# Altium project STM32F407_board.PrjPcb
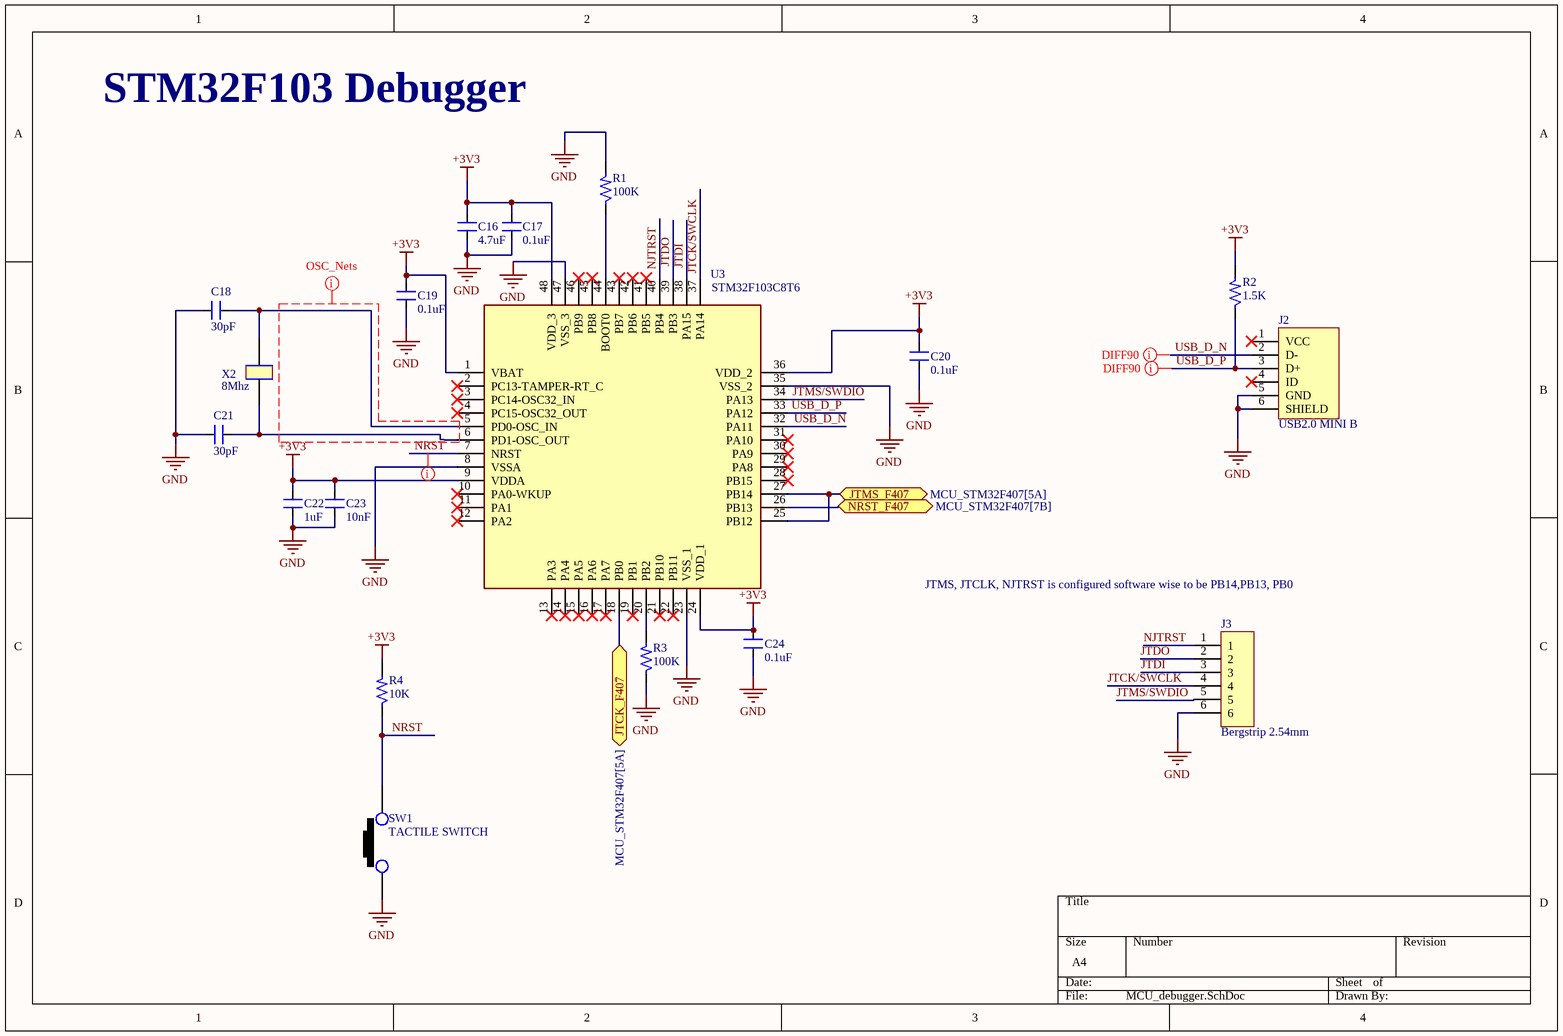
[diagram p0: MCU_debugger.SchDoc]
3 sheets, 73 parts. Net scope: flat (ports and power ports of the same name join across sheets).
Sheets:
  MCU_debugger.SchDoc
  Ethernet_PHY.SchDoc
  Motor_Driver.SchDoc

## Sheet MCU_debugger.SchDoc
size A4; DocumentNumber: 2; SheetNumber: 2; SheetTotal: 6

### Parts
C16  4.7uF  [CAP_0805]
C17  0.1uF  [CAP_0805]
C18  30pF  [CAP_0805]
C19  0.1uF  [CAP_0805]
C20  0.1uF  [CAP_0805]
C21  30pF  [CAP_0805]
C22  1uF  [CAP_0805]
C23  10nF  [CAP_0805]
C24  0.1uF  [CAP_0805]
J2  USB2.0 MINI B  [CON_690-005-299-043]
J3  Bergstrip 2.54mm  [CON6_100_59D78_TH_ST]
R1  100K  [RES_0603]
R2  1.5K  [RES_0805]
R3  100K  [RES_0603]
R4  10K  [RES_0603]
SW1  TACTILE SWITCH  [SW_342_SMD]
U3  STM32F103C8T6  [LQFP-48_19.6_393_58X11_SMD]
X2  8Mhz  [XTAL_314_240X47_SMD]

### Ports
JTCK_F407 (bidir, see MCU_STM32F407[5A]), JTMS_F407 (bidir, see MCU_STM32F407[5A]), NRST_F407 (bidir, see MCU_STM32F407[7B])

### Nets
+3V3: C16.2 C17.2 C19.2 C20.2 C22.2 C23.2 C24.2 R2.2 R4.2 U3.1(VBAT) U3.9(VDDA) U3.24(VDD_1) U3.36(VDD_2) U3.48(VDD_3)
GND: C16.1 C17.1 C18.1 C19.1 C20.1 C21.1 C22.1 C23.1 C24.1 J2.5(GND) J2.6(SHIELD) J3.6 R1.2 R3.1 SW1.1 U3.8(VSSA) U3.23(VSS_1) U3.35(VSS_2) U3.47(VSS_3)
JTCK/SWCLK: J3.4 U3.37(PA14)
JTDI: J3.3 U3.38(PA15)
JTDO: J3.2 U3.39(PB3)
JTMS/SWDIO: J3.5 U3.34(PA13)
NJTRST: J3.1 U3.40(PB4)
NRST: R4.1 SW1.2 U3.7(NRST)
USB_D_N: J2.2(D-) U3.32(PA11)
USB_D_P: J2.3(D+) R2.1 U3.33(PA12)
NetC18_2: C18.2 U3.5(PD0-OSC_IN) X2.2
NetC21_2: C21.2 U3.6(PD1-OSC_OUT) X2.1
NetR1_1: R1.1 U3.44(BOOT0)
NetR3_2: R3.2 U3.20(PB2)
NetU3_18: U3.18(PB0) ; port JTCK_F407
NetU3_25: U3.25(PB12) U3.27(PB14) ; port JTMS_F407
NetU3_26: U3.26(PB13) ; port NRST_F407

Not connected (* = marked no-connect by the designer): J2 1(VCC)* 4(ID)*; U3 2(PC13-TAMPER-RT_C)* 3(PC14-OSC32_IN)* 4(PC15-OSC32_OUT)* 10(PA0-WKUP)* 11(PA1)* 12(PA2)* 13(PA3)* 14(PA4)* 15(PA5)* 16(PA6)* 17(PA7)* 19(PB1)* 21(PB10)* 22(PB11)* 28(PB15)* 29(PA8)* 30(PA9)* 31(PA10)* 41(PB5)* 42(PB6)* 43(PB7)* 45(PB8)* 46(PB9)*

### Layout directives
differential pair; differential pair class DIFF90: USB_D_N, USB_D_P
net class OSC_Nets: GND
net class *: NRST

### Notes on the sheet
- STM32F103 Debugger
- (near J3) JTMS, JTCLK, NJTRST is configured software wise to be PB14,PB13, PB0

### Library data of the parts
C16 = CAP_4.7uF-50V-10%-0805: 4.7µF ±10% 50V Ceramic Capacitor X5R 0805 (2012 Metric); Manufacturer: Yageo; Manufacturer Part Number: GRM21BR61H475KE51L; Alternate Part Number-1: NA; Case/Package: 0805; Supplier-1: SIRICOM; Supplier Part Number-1: CL21A475KBQNNNE
C17 C19 C20 C24 = CAP_0.1uF-50V-5%-0805: 0.1µF ±5% 50V Ceramic Capacitor X7R 0805 (2012 Metric); Manufacturer: AVX Corporation; Manufacturer Part Number: 08055C104JAT4A; Alternate Part Number-1: 0805B104M500; Case/Package: 0805; Supplier-1: SIRICOM; Supplier Part Number-1: 0805B104J500CT
C18 C21 = CAP_30pF-50V-10%-0805: ±10% 50V Ceramic Capacitor C0G, NP0 0805 (2012 Metric); Manufacturer Part Number: C0805C300K5GAC7800; Manufacturer: KEMET; Alternate Part Number: NA; Case/Package: 0805; Supplier-1: Digikey; Supplier Part Number-1: 399-17443-1-ND - Cut Tape (CT)
C22 = CAP_1uF-50V-5%-0805: 1µF ±5% 50V Ceramic Capacitor X7R 0805 (2012 Metric); Manufacturer: Samsung; Manufacturer Part Number: CC0805JKX7R9BB105; Alternate Part Number-1: 0805F105M500NT; Case/Package: 0805; Supplier-1: SIRICOM; Supplier Part Number-1: CL21B105KBFNNNE
C23 = CAP_10nF-50V-10%-0805: 10000pF ±10% 50V Ceramic Capacitor X7R 0805 (2012 Metric); Manufacturer: Samsung; Manufacturer Part Number: C0805C103K5RECAUTO; Alternate Part Number-1: GRM2195C1H103JA01D; Case/Package: 0805; Supplier-1: SIRICOM; Supplier Part Number-1: 0805B103K500CT
J2 = CON_USB2.0-MINIB-SMD: USB - mini B USB 2.0 Receptacle Connector 5 Position Surface Mount, Right Angle; Manufacturer: EDAC; Manufacturer Part Number: 690-005-299-043; Alternate Part Number-1: NA; Case/Package: USB-MINI-B; Supplier-1: LCSC; Supplier Part Number-1: C105424
J3 = CON-BS-SKT_6X1-100-ST-TH: 6 Pins, 1 Row 2.54mm Pitch, Straight bergstrip, Female; Manufacturer: Molex; Alternate Part Number-1: NA; Manufacturer Part Number: 22-10-2061; Case/Package: TH-CON; Supplier-1: SP ROAD; Supplier Part Number-1: NA
R1 R3 = RES_100K-0.1W-1%-0603: 100 kOhms ±1% 0.1W, 1/10W Chip Resistor 0603 (1608 Metric) Automotive AEC-Q200 Thick Film; Manufacturer: Stackpole Electronics; Manufacturer Part Number: RMCF0603FT100K; Alternate Part Number-1: NA; Case/Package: 0603; Supplier-1: Arrow; Supplier Part Number-1: RMCF0603FT100K
R2 = RES_1.5K-0.125W-1%-0805: 1.5 kOhms ±1% 0.125W, 1/8W Chip Resistor 0805 (2012 Metric) Thick Film; Manufacturer: TE Connectivity Passive Product; Manufacturer Part Number: CRG0805F1K5; Alternate Part Number-1: NA; Case/Package: 0805; Supplier-1: SIRICOM; Supplier Part Number-1: NA
R4 = RES_10K-0.1W-1%-0603: 10 kOhms ±1% 0.1W, 1/10W Chip Resistor 0603 (1608 Metric) Automotive AEC-Q200 Thick Film; Manufacturer: Walsin; Manufacturer Part Number: WR06X1002FTL; Alternate Part Number-1: 0603WAJ0103T5E; Case/Package: 0603; Supplier-1: SIRICOM; Supplier Part Number-1: WR06X1002FTL
SW1 = SW1_RS-282G05A3-SMRT-SMD: Tactile Switch SPST-NO Top Actuated Surface Mount; Manufacturer: ITT C&K; Alternate Part Number-1: NA; Manufacturer Part Number: RS-282G05A3-SMRT; Case/Package: SMD; Supplier-1: SP ROAD; Supplier Part Number-1: RS-282G05A3-SMRT
U3 = IC_STM32F103C8T6: ARM® Cortex®-M3 STM32F1 Microcontroller IC 32-Bit 72MHz 64KB (64K x 8) FLASH 48-LQFP (7x7); Manufacturer: STMicroelectronics; Alternate Part Number-1: NA; Manufacturer Part Number: STM32F103C8T6; Case/Package: LQFP48; Supplier-1: LCSC; Supplier Part Number-1: STM32F103C8T6
X2 = XTAL_8MHZ-ECS-80-32-5PX-SMD: 8MHz ±30ppm Crystal 32pF 60 Ohms HC-49/US; Manufacturer: Fox Electronics; Manufacturer Part Number: ECS-80-32-5PX-TR; Alternate Part Number-1: NA; Case/Package: SMD/SMT; Supplier-1: SP ROAD; Supplier Part Number-1: ECS-80-32-5PX-TR

## Sheet Ethernet_PHY.SchDoc
size A4; DocumentNumber: 3; SheetNumber: 3; SheetTotal: 7
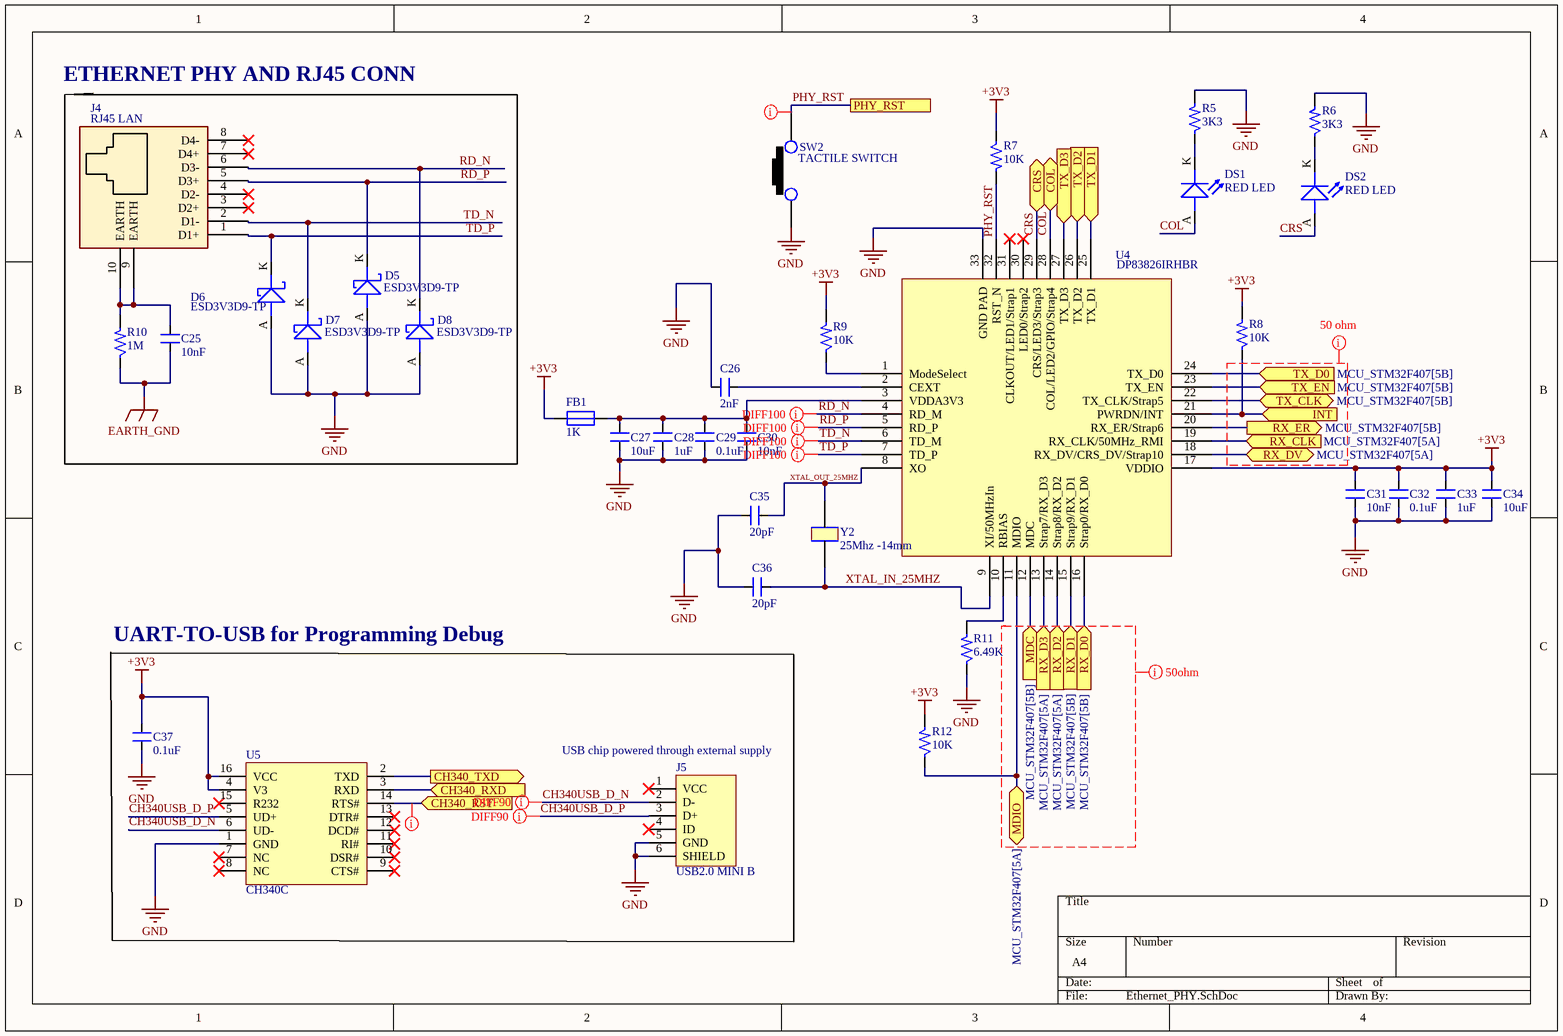
[diagram p1: Ethernet_PHY.SchDoc]

### Parts
C25  10nF  [CAP_P196_102X287_H332_RAD_TH]
C26  2nF  [CAP_0805]
C27  10uF  [CAP_1206]
C28  1uF  [CAP_0805]
C29  0.1uF  [CAP_0805]
C30  10nF  [CAP_0805]
C31  10nF  [CAP_0805]
C32  0.1uF  [CAP_0805]
C33  1uF  [CAP_0805]
C34  10uF  [CAP_1206]
C35  20pF  [CAP_0805]
C36  20pF  [CAP_0805]
C37  0.1uF  [CAP_0805]
D5  ESD3V3D9-TP  [DIO_SOD-923]
D6  ESD3V3D9-TP  [DIO_SOD-923]
D7  ESD3V3D9-TP  [DIO_SOD-923]
D8  ESD3V3D9-TP  [DIO_SOD-923]
DS1  RED LED  [LED_0805]
DS2  RED LED  [LED_0805]
FB1  1K  [IND_0805]
J4  RJ45 LAN  [CON10_P106_RJ45_TH_ST]
J5  USB2.0 MINI B  [CON_690-005-299-043]
R5  3K3  [RES_0603]
R6  3K3  [RES_0603]
R7  10K  [RES_0603]
R8  10K  [RES_0603]
R9  10K  [RES_0603]
R10  1M  [RES_1206]
R11  6.49K  [RES_0805]
R12  10K  [RES_0603]
SW2  TACTILE SWITCH  [SW_342_SMD]
U4  DP83826IRHBR  [VQFN32_19_218_23X9_SMD]
U5  CH340C  [SOIC16_50_284_25X90_SMT]
Y2  25Mhz -14mm  [XTAL_314_240X47_SMD]

### Blocks framed on the sheet
UART-TO-USB for Programming Debug: C37 J5 U5

### Ports
CH340_RST (in, see MCU_STM32F407[7B]), CH340_RXD (in, see MCU_STM32F407[5B]), CH340_TXD (out, see MCU_STM32F407[5B]), COL (bidir, see MCU_STM32F407[5A]), CRS (bidir, see MCU_STM32F407[5A]), INT (in), MDC (in, see MCU_STM32F407[5B]), MDIO (bidir, see MCU_STM32F407[5A]), PHY_RST (see MCU_STM32F407[5B]), RX_CLK (in, see MCU_STM32F407[5A]), RX_D0 (in, see MCU_STM32F407[5B]), RX_D1 (in, see MCU_STM32F407[5B]), RX_D2 (in, see MCU_STM32F407[5A]), RX_D3 (in, see MCU_STM32F407[5A]), RX_DV (bidir, see MCU_STM32F407[5A]), RX_ER (out, see MCU_STM32F407[5B]), TX_CLK (bidir, see MCU_STM32F407[5B]), TX_D0 (in, see MCU_STM32F407[5B]), TX_D1 (in, see MCU_STM32F407[5B]), TX_D2 (in, see MCU_STM32F407[5B]), TX_D3 (in, see MCU_STM32F407[7A]), TX_EN (in, see MCU_STM32F407[5B])

### Nets
+3V3: C31.2 C32.2 C33.2 C34.2 C37.2 FB1.1 R7.1 R8.2 R9.2 R12.2 U4.17(VDDIO) U5.4(V3) U5.16(VCC)
EARTH_GND: C25.1 R10.1
GND: C26.2 C27.1 C28.1 C29.1 C30.1 C31.1 C32.1 C33.1 C34.1 C35.1 C36.1 C37.1 D5.A D6.A D7.A D8.A J5.5(GND) J5.6(SHIELD) R5.2 R6.2 R11.1 SW2.1 U4.33(GND_PAD) U5.1(GND)
CH340USB_D_N: J5.2(D-) U5.6(UD-)
CH340USB_D_P: J5.3(D+) U5.5(UD+)
COL: DS1.A(ANODE) U4.28(COL/LED2/GPIO/Strap4) ; port COL
CRS: DS2.A(ANODE) U4.29(CRS/LED3/Strap3) ; port CRS
PHY_RST: R7.2 SW2.2 U4.32(RST_N) ; port PHY_RST
RD_N: D8.K J4.6(D3-) U4.4(RD_M)
RD_P: D5.K J4.5(D3+) U4.5(RD_P)
TD_N: D7.K J4.2(D1-) U4.6(TD_M)
TD_P: D6.K J4.1(D1+) U4.7(TD_P)
XTAL_IN_25MHZ: C36.2 U4.9(XI/50MHzIn) Y2.2
XTAL_OUT_25MHZ: C35.2 U4.8(XO) Y2.1
NetC25_2: C25.2 J4.9(EARTH) J4.10(EARTH) R10.2
NetC26_1: C26.1 U4.2(CEXT)
NetC27_2: C27.2 C28.2 C29.2 C30.2 FB1.2 U4.3(VDDA3V3)
NetDS1_K: DS1.K(CATHODE) R5.1
NetDS2_K: DS2.K(CATHODE) R6.1
NetR8_1: R8.1 U4.21(PWRDN/INT) ; port INT
NetR9_1: R9.1 U4.1(ModeSelect)
NetR11_2: R11.2 U4.10(RBIAS)
NetR12_1: R12.1 U4.11(MDIO) ; port MDIO
NetU4_12: U4.12(MDC) ; port MDC
NetU4_13: U4.13(Strap7/RX_D3) ; port RX_D3
NetU4_14: U4.14(Strap8/RX_D2) ; port RX_D2
NetU4_15: U4.15(Strap9/RX_D1) ; port RX_D1
NetU4_16: U4.16(Strap0/RX_D0) ; port RX_D0
NetU4_18: U4.18(RX_DV/CRS_DV/Strap10) ; port RX_DV
NetU4_19: U4.19(RX_CLK/50MHz_RMI) ; port RX_CLK
NetU4_20: U4.20(RX_ER/Strap6) ; port RX_ER
NetU4_22: U4.22(TX_CLK/Strap5) ; port TX_CLK
NetU4_23: U4.23(TX_EN) ; port TX_EN
NetU4_24: U4.24(TX_D0) ; port TX_D0
NetU4_25: U4.25(TX_D1) ; port TX_D1
NetU4_26: U4.26(TX_D2) ; port TX_D2
NetU4_27: U4.27(TX_D3) ; port TX_D3
NetU5_2: U5.2(TXD) ; port CH340_TXD
NetU5_3: U5.3(RXD) ; port CH340_RXD
NetU5_14: U5.14(RTS#) ; port CH340_RST

Not connected (* = marked no-connect by the designer): J4 3(D2+)* 4(D2-)* 7(D4+)* 8(D4-)*; J5 1(VCC)* 4(ID)*; U4 30(LED0/Strap2)* 31(CLKOUT/LED1/Strap1)*; U5 7(NC)* 8(NC)* 9(CTS#)* 10(DSR#)* 11(RI#)* 12(DCD#)* 13(DTR#)* 15(R232)*

### Layout directives
differential pair; differential pair class DIFF100: RD_N, RD_P, TD_N, TD_P
differential pair; differential pair class DIFF90: CH340USB_D_N, CH340USB_D_P
mark named 50ohm: (no net found under the mark)
mark named 50 ohm: (no net found under the mark)
net class Critical Nets: NetU5_14, PHY_RST

### Notes on the sheet
- (near J4) ETHERNET PHY AND RJ45 CONN
- (near J5) USB chip powered through external supply

### Library data of the parts
C25 = CAP_10nF-1KV-10%-RAD-TH: 10000pF ±10% 1000V (1kV) Ceramic Capacitor X7R Radial; Manufacturer: Yageo; Manufacturer Part Number: RDER73A103K2K1H03B; Alternate Part Number-1: NA; Case/Package: TH; Supplier-1: SP ROAD; Supplier Part Number-1: RDER73A103K2K1H03B
C26 = CAP_2nF-50V-10%-0805: 2000pF ±10% 50V Ceramic Capacitor X7R 0805 (2012 Metric); Manufacturer: Samsung Electro-Mechanics; Manufacturer Part Number: CL21B202KBANNNC; Alternate Part Number-1: NA; Case/Package: 0805; Supplier-1: Digikey; Supplier Part Number-1: 1276-2471-1-ND - Cut Tape (CT)
C27 C34 = CAP_10uF-50V-10%-1206: 10µF ±10% 50V Ceramic Capacitor X7R 1206 (3216 Metric); Manufacturer: KEMET; Manufacturer Part Number: CL31B106KBHNNNE; Alternate Part Number-1: GRT31CR61H106ME01L; Case/Package: 1206; Supplier-1: SIRICOM; Supplier Part Number-1: CC1206KKX5R9BB106
C28 C33 = CAP_1uF-50V-5%-0805: as C22 on sheet MCU_debugger; Case/Package: 0805; Supplier-1: SIRICOM; Supplier Part Number-1: CL21B105KBFNNNE
C29 C32 = CAP_0.1uF-50V-10%-0805: 0.1µF ±10% 50V Ceramic Capacitor X7R 0805 (2012 Metric); Manufacturer: Samsung; Manufacturer Part Number: CL21B104KBCNNNC; Alternate Part Number-1: NA; Case/Package: 0805; Supplier-1: SIRICOM; Supplier Part Number-1: 0805B104K500CT
C30 C31 = CAP_10nF-50V-10%-0805: as C23 on sheet MCU_debugger; Case/Package: 0805; Supplier-1: SIRICOM; Supplier Part Number-1: 0805B103K500CT
C35 C36 = CAP_20pF-50V-10%-0805: ±10% 50V Ceramic Capacitor C0G, NP0 0805 (2012 Metric); Manufacturer: AVX Corporation; Manufacturer Part Number: 08055A200KAT2A; Alternate Part Number-1: NA; Case/Package: 0805; Supplier-1: Digikey; Supplier Part Number-1: 478-11887-1-ND - Cut Tape (CT)
C37 = CAP_0.1uF-50V-5%-0805: as C17 on sheet MCU_debugger; Case/Package: 0805; Supplier-1: SIRICOM; Supplier Part Number-1: 0805B104J500CT
D5-D8 = DIO-T_3.3V-8.8V-SOD923: 8.8V Clamp 5A (8/20µs) Ipp Tvs Diode Surface Mount SOD-923; Manufacturer: Micro Commercial Co; Alternate Part Number-1: NA; Manufacturer Part Number: ESD3V3D9-TP; Case/Package: SOD923; Supplier-1: Digikey; Supplier Part Number-1: ESD3V3D9-TPMSCT-ND - Cut Tape (CT)
DS1 DS2 = LED_RED-2V-20mA-0805: Red 631nm LED Indication - Discrete 2V 0805 (2012 Metric); Manufacturer: Vishay Lite-On; Manufacturer Part Number: LTST-C171KRKT; Alternate Part Number-1: NA; Case/Package: 0805; Supplier-1: SP ROAD; Supplier Part Number-1: LTST-C171KRKT
FB1 = FB_1K-100MHZ-1.6A-0805: 1 kOhms @ 100MHz 1 Power Line Ferrite Bead 0805 (2012 Metric) 1.6A; Manufacturer: Laird; Manufacturer Part Number: BLM21SP102SH1D; Alternate Part Number-1: NA; Case/Package: 0805; Supplier-1: SIRICOM; Supplier Part Number-1: ACMS201209A102
J4 = CON-SKT-RJ_8C8P-RA-TH: 8 Pins, 2 Row 2.54mm Pitch, right angle Connector, male; Manufacturer: Assmann; Manufacturer Part Number: A-2004-2-4-LPS-N-R; Alternate Part Number-1: NA; Case/Package: TH-CON; Supplier-1: SP ROAD; Supplier Part Number-1: A-2004-2-4-LPS-N-R
J5 = CON_USB2.0-MINIB-SMD: as J2 on sheet MCU_debugger; Case/Package: USB-MINI-B; Supplier-1: LCSC; Supplier Part Number-1: C105424
R5 R6 = RES_3.3K-0.1W-1%-0603: 3.3 kOhms ±1% 0.1W, 1/10W Chip Resistor 0603 (1608 Metric) Automotive AEC-Q200 Thick Film; Manufacturer: Wilson; Manufacturer Part Number: WR06X3301FTL; Alternate Part Number-1: 0603WAF3301T5E; Case/Package: 0603; Supplier-1: SIRICOM; Supplier Part Number-1: WR06X3301FTL
R7-R9 R12 = RES_10K-0.1W-1%-0603: as R4 on sheet MCU_debugger; Case/Package: 0603; Supplier-1: SIRICOM; Supplier Part Number-1: WR06X1002FTL
R10 = RES_1M-0.25W-1%-1206: 1 MOhms ±1% 0.25W, 1/4W Chip Resistor 1206 (3216 Metric) Automotive AEC-Q200, High Voltage Thick Film; Manufacturer: Walsin; Manufacturer Part Number: WR12X1004FTL; Alternate Part Number-1: NA; Case/Package: 1206; Supplier-1: SIRICOM; Supplier Part Number-1: WR12X1004FTL
R11 = RES_6.49K-0.125W-1%-0805: 6.49 kOhms ±1% 0.125W, 1/8W Chip Resistor 0805 (2012 Metric) Moisture Resistant Thick Film; Manufacturer: Stackpole Electronics; Manufacturer Part Number: RC0805FR-076K49L; Alternate Part Number-1: NA; Case/Package: 0805; Supplier-1: SIRICOM; Supplier Part Number-1: WRO8X6491FTL
SW2 = SW1_RS-282G05A3-SMRT-SMD: as SW1 on sheet MCU_debugger; Manufacturer Part Number: RS-282G05A3-SMRT; Case/Package: SMD; Supplier-1: SP ROAD; Supplier Part Number-1: RS-282G05A3-SMRT
U4 = IC_DP83826IRHBR: Ethernet ICs Low latency 10/100-Mbps PHY, MII interface and enhanced mode with an industrial temperature range 32-VQFN -40 to 85; Manufacturer: Texas Instruments; Alternate Part Number-1: NA; Manufacturer Part Number: DP83826IRHBR; Case/Package: 32-VQFN; Supplier-1: Mouser; Supplier Part Number-1: 595-DP83826IRHBR
U5 = IC_CH340C: USB Bridge, USB to UART USB 2.0 UART Interface; Manufacturer: Olimex; Alternate Part Number-1: NA; Manufacturer Part Number: CH340C; Case/Package: SOIC16; Supplier-1: LCSC; Supplier Part Number-1: C84681
Y2 = XTAL_25Mhz-FOXSDLF/250F-20: 25MHz ±30ppm Crystal 20pF 30 Ohms HC-49/US; Manufacturer: Abracon; Alternate Part Number-1: NA; Manufacturer Part Number: FOXSDLF/250F-20; Case/Package: SMD; Supplier-1: MOUSER; Supplier Part Number-1: FOXSDLF/250F-20

## Sheet Motor_Driver.SchDoc
size A4; DocumentNumber: 4; SheetNumber: 4; SheetTotal: 6
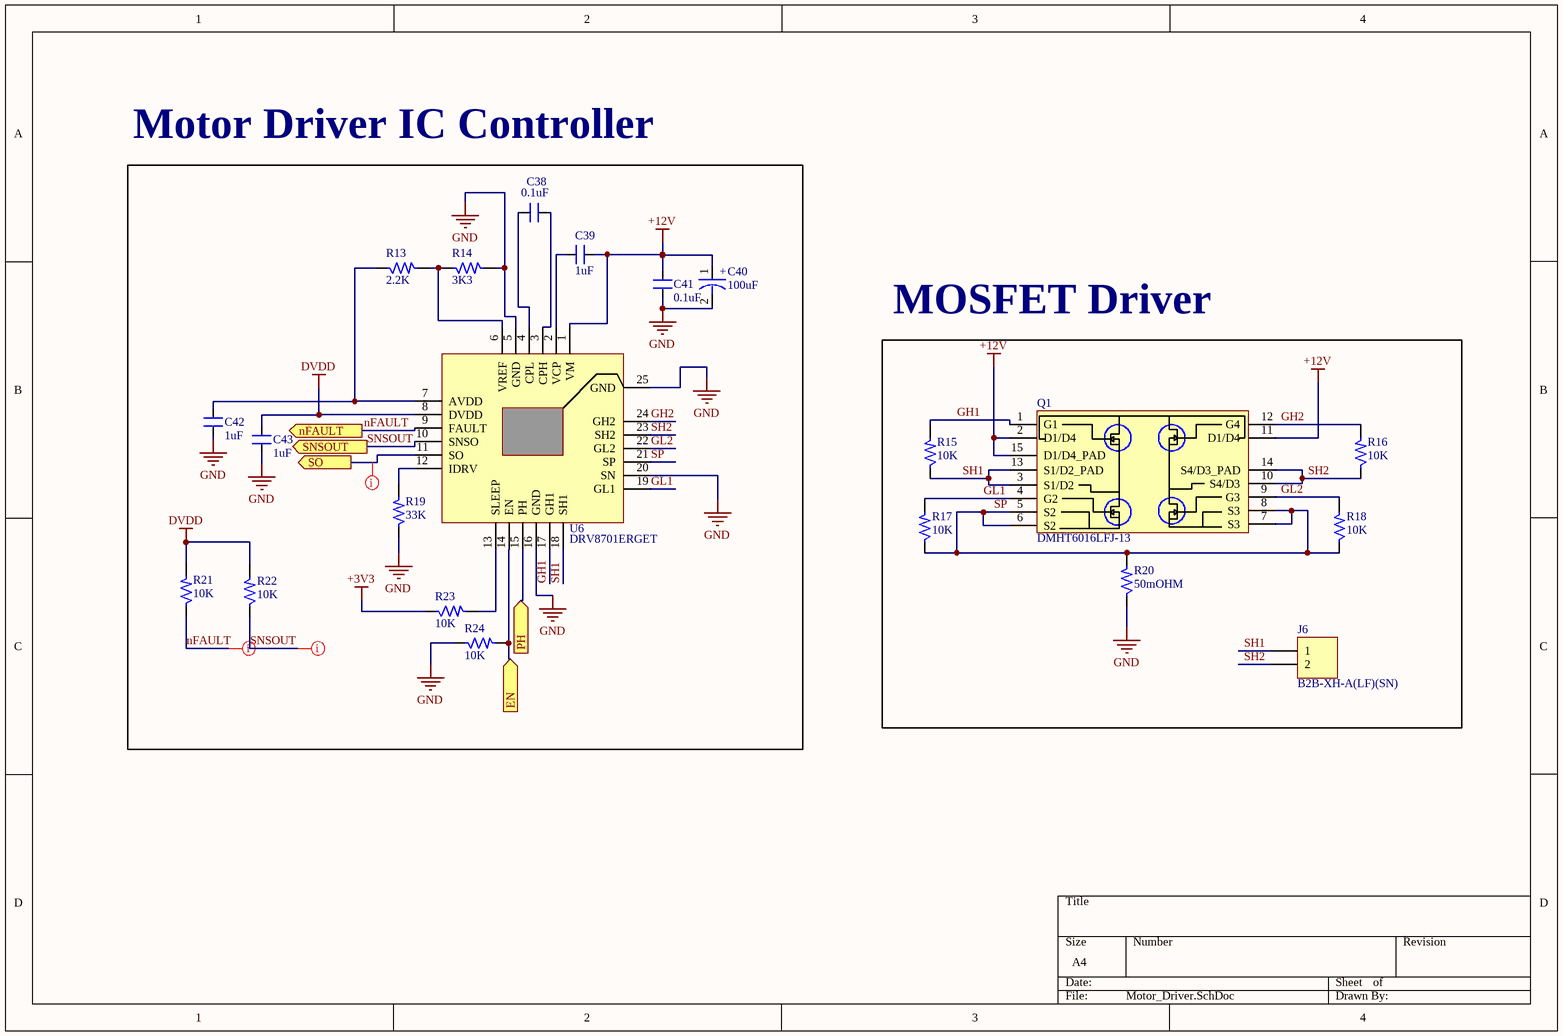
[diagram p2: Motor_Driver.SchDoc]

### Parts
C38  0.1uF  [CAP_0805]
C39  1uF  [CAP_0805]
C40  100uF  [ACAP_P305_D393_H393_RAD]
C41  0.1uF  [CAP_0805]
C42  1uF  [CAP_0805]
C43  1uF  [CAP_0805]
J6  B2B-XH-A(LF)(SN)  [CON2_100_B2B-XH-A_TH_ST]
Q1  DMHT6016LFJ-13  [DFN5045-12_33_212_27X15_SMD_1]
R13  2.2K  [RES_0603]
R14  3K3  [RES_0603]
R15  10K  [RES_0603]
R16  10K  [RES_0603]
R17  10K  [RES_0603]
R18  10K  [RES_0603]
R19  33K  [RES_0805]
R20  50mOHM  [RES_2512]
R21  10K  [RES_0603]
R22  10K  [RES_0603]
R23  10K  [RES_0603]
R24  10K  [RES_0603]
U6  DRV8701ERGET  [VFQFN24_19.6_196_12X32_SMD_1]

### Blocks framed on the sheet
Motor Driver IC Controller: C38-C43 R13 R14 R19 R21-R24 U6
MOSFET Driver: J6 Q1 R15-R18 R20

### Ports
EN (in, see MCU_STM32F407[7A]), nFAULT (out, see MCU_STM32F407[7B]), PH (in, see MCU_STM32F407[5B]), SNSOUT (out, see MCU_STM32F407[7B]), SO (out, see MCU_STM32F407[5A])

### Nets
+3V3: R23.1
+12V: C39.1 C40.1 C41.2 Q1.2(D1/D4) Q1.11(D1/D4) Q1.15(D1/D4_PAD) U6.1(VM)
DVDD: C43.2 R21.2 R22.2 U6.8(DVDD)
GND: C40.2 C41.1 C42.1 C43.1 R14.2 R19.1 R20.1 R24.1 U6.5(GND) U6.16(GND) U6.20(SN) U6.25(GND)
GH1: Q1.1(G1) R15.2 U6.17(GH1)
GH2: Q1.12(G4) R16.2 U6.24(GH2)
GL1: Q1.4(G2) R17.2 U6.19(GL1)
GL2: Q1.9(G3) R18.2 U6.22(GL2)
nFAULT: R21.1 U6.9(FAULT) ; port nFAULT
SH1: J6.1 Q1.3(S1/D2) Q1.13(S1/D2_PAD) R15.1 U6.18(SH1)
SH2: J6.2 Q1.10(S4/D3) Q1.14(S4/D3_PAD) R16.1 U6.23(SH2)
SNSOUT: R22.1 U6.10(SNSO) ; port SNSOUT
SP: Q1.5(S2) Q1.6(S2) Q1.7(S3) Q1.8(S3) R17.1 R18.1 R20.2 U6.21(SP)
NetC38_1: C38.1 U6.3(CPH)
NetC38_2: C38.2 U6.4(CPL)
NetC39_2: C39.2 U6.2(VCP)
NetC42_2: C42.2 R13.1 U6.7(AVDD)
NetR13_2: R13.2 R14.1 U6.6(VREF)
NetR19_2: R19.2 U6.12(IDRV)
NetR23_2: R23.2 U6.13(SLEEP)
NetR24_2: R24.2 U6.14(EN) ; port EN
NetU6_11: U6.11(SO) ; port SO
NetU6_15: U6.15(PH) ; port PH

### Layout directives
net class Critical Nets: NetU6_11, nFAULT, SNSOUT

### Notes on the sheet
- (in symbol CAP-P_100uF-50V-20%-RAD) +

### Library data of the parts
C38 C41 = CAP_0.1uF-50V-10%-0805: as C29 on sheet Ethernet_PHY; Case/Package: 0805; Supplier-1: SIRICOM; Supplier Part Number-1: 0805B104K500CT
C39 C42 C43 = CAP_1uF-50V-5%-0805: as C22 on sheet MCU_debugger; Case/Package: 0805; Supplier-1: SIRICOM; Supplier Part Number-1: CL21B105KBFNNNE
C40 = CAP-P_100uF-50V-20%-RAD: 100µF 50V Aluminum Polymer Capacitor Radial, Can - SMD 28mOhm 4000 Hrs @ 125°C; Manufacturer: Nichicon; Manufacturer Part Number: GYA1H101MCQ1GS; Alternate Part Number-1: VEU101M1HTR-1010; Case/Package: Radial-SMD; Supplier-1: SP ROAD; Supplier Part Number-1: GYA1H101MCQ1GS
J6 = CON-PLG_2X1-100-ST-TH: 2 Pins, 1 Row 2.54mm Pitch, Straight Connector, male; Manufacturer: JST; Mating Part Number: XHP-2; Crimp Part Number: ASXHSXH22K51; Alternate Part Number-1: NA; Manufacturer Part Number: B2B-XH-A(LF)(SN); Case/Package: TH-CON; Supplier-1: SP ROAD; Supplier Part Number-1: B2B-XH-A(LF)(SN)
Q1 = MOSFET-N_60V-14.8A-V-DFN5045-12: Mosfet Array 4 N-Channel 14.8A (Ta) Surface Mount V-DFN5045-12; Manufacturer: ON Semiconductor; Alternate Part Number-1: DMHT3006LFJ-13; Manufacturer Part Number: DMHT6016LFJ-13; Case/Package: DFN5045-12; Supplier-1: LCSC; Supplier Part Number-1: C460986
R13 = RES_2.2K-0.1W-1%-0603: 2.2 kOhms ±1% 0.1W, 1/10W Chip Resistor 0603 (1608 Metric) Automotive AEC-Q200 Thick Film; Manufacturer: Walsin; Manufacturer Part Number: WR06X2201FTL; Case/Package: 0603; Supplier-1: SIRICOM; Supplier Part Number-1: WR06X2201FTL; Alternate Part Number-1: WR06X2201FTL
R14 = RES_3.3K-0.1W-1%-0603: as R5 on sheet Ethernet_PHY; Case/Package: 0603; Supplier-1: SIRICOM; Supplier Part Number-1: WR06X3301FTL
R15-R18 R21-R24 = RES_10K-0.1W-1%-0603: as R4 on sheet MCU_debugger; Case/Package: 0603; Supplier-1: SIRICOM; Supplier Part Number-1: WR06X1002FTL
R19 = RES_33K-0.125W-1%-0805: Thick Film Resistors - SMD 33KOhms 1/8W 150V33 kOhms ±1% 0.125W, 1/8W Chip Resistor 0805 (2012 Metric) Thick Film; Manufacturer: Vishay BCcomponents; Manufacturer Part Number: CRG0805F33K; Alternate Part Number-1: NA; Case/Package: 0805; Supplier-1: SIRICOM; Supplier Part Number-1: WR08X3302FTL
R20 = RES_50mOhm-2W-1%-2512: 50 mOhms ±1% 2W Chip Resistor 2512 (6432 Metric) Automotive AEC-Q200, Current Sense, Moisture Resistant Metal Element; Manufacturer: Yageo; Manufacturer Part Number: PA2512FKF7W0R05E; Alternate Part Number-1: PMR100HZPFU5L00; Case/Package: 2512; Supplier-1: SIRICOM; Supplier Part Number-1: LR2512-22R060F1
U6 = IC_DRV8701ERGET: Motor Driver Power MOSFET Parallel 24-VQFN (4x4); Manufacturer: Texas Instruments; Alternate Part Number-1: NA; Manufacturer Part Number: DRV8701ERGET; Case/Package: VFQFN24; Supplier-1: ARROW; Supplier Part Number-1: DRV8701ERGET

## Nets that join several sheets
+3V3: MCU_debugger (14 pins), Ethernet_PHY (13 pins), Motor_Driver (R23.1)
GND: MCU_debugger (19 pins), Ethernet_PHY (24 pins), Motor_Driver (12 pins)